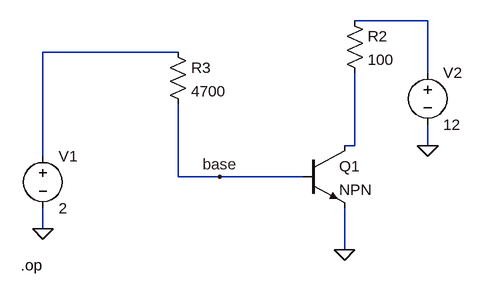
[diagram p0: schematic biasSim.asc]
biasSim.asc, the LTspice schematic file:
Version 4
SHEET 1 880 680
WIRE 336 -80 224 -80
WIRE -48 -32 -256 -32
WIRE 336 0 336 -80
WIRE 224 112 224 0
WIRE 224 112 208 112
WIRE 336 112 336 80
WIRE -256 128 -256 -32
WIRE -48 160 -48 48
WIRE 16 160 -48 160
WIRE 144 160 16 160
WIRE -256 240 -256 208
WIRE 208 272 208 208
FLAG 208 272 0
FLAG -256 240 0
FLAG 336 112 0
FLAG 16 160 base
DATAFLAG 224 48 ""
SYMBOL npn 144 112 R0
SYMATTR InstName Q1
SYMBOL res 208 -96 R0
SYMATTR InstName R2
SYMATTR Value 100
SYMBOL res -64 -48 R0
SYMATTR InstName R3
SYMATTR Value 4700
SYMBOL voltage -256 112 R0
WINDOW 123 0 0 Left 0
WINDOW 39 0 0 Left 0
SYMATTR InstName V1
SYMATTR Value 2
SYMBOL voltage 336 -16 R0
SYMATTR InstName V2
SYMATTR Value 12
TEXT -290 296 Left 2 !.op

The netlist it stands for:
* biasSim.asc
Q1 N003 base 0 0 NPN
R2 N001 N003 100
R3 N002 base 4700
V1 N002 0 2
V2 N001 0 12
.model NPN NPN
.model PNP PNP
.lib standard.bjt
.op
.backanno
.end